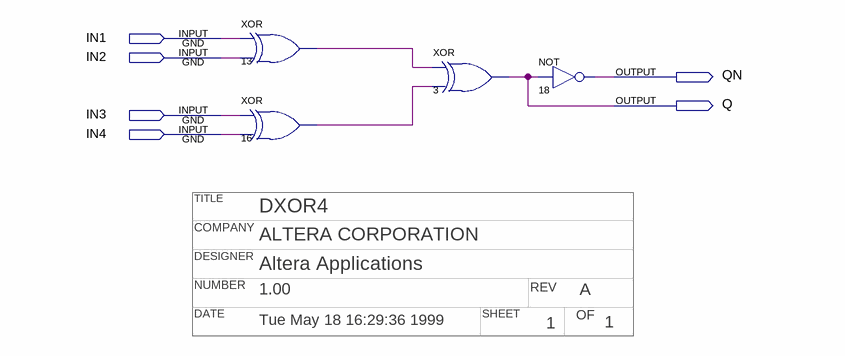
[diagram p0: schematic sheet]
// Quartus schematic dxor4.bdf as structural Verilog: 4 symbols, 6 pins
// Title block: TITLE: DXOR4; COMPANY: ALTERA CORPORATION; DESIGNER: Altera Applications; NUMBER: 1.00; REV: A; DATE: Tue May 18 16:29:36 1999; SHEET: 1; OF: 1
module dxor4 (
  input  IN1,
  input  IN2,
  input  IN3,
  input  IN4,
  output QN,
  output Q
);

  wire n13_out, n16_out;

  xor u_13 (n13_out, IN1, IN2);
  xor u_16 (n16_out, IN3, IN4);
  xor u_3 (Q, n13_out, n16_out);
  not u_18 (QN, Q);
endmodule
